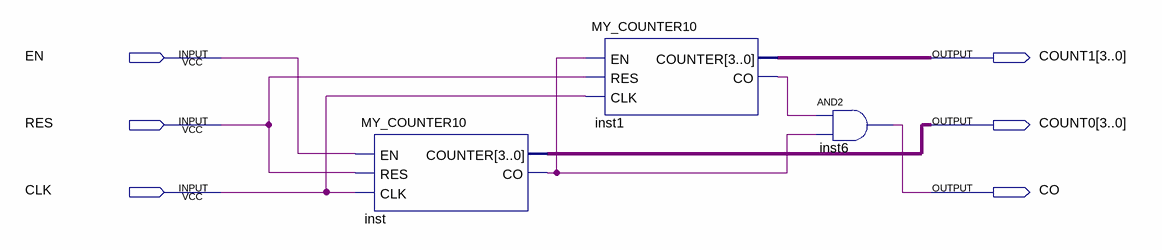
[diagram p0: schematic sheet]
// Quartus schematic MY_COUNTER100.bdf as structural Verilog: 3 symbols, 6 pins
module MY_COUNTER100 (
  input  EN,
  input  RES,
  input  CLK,
  output [3:0] COUNT1,
  output [3:0] COUNT0,
  output CO
);

  wire inst1_co, inst_co;

  MY_COUNTER10 inst (.EN(EN), .RES(RES), .CLK(CLK), .COUNTER(COUNT0), .CO(inst_co));
  MY_COUNTER10 inst1 (.EN(inst_co), .RES(RES), .CLK(CLK), .COUNTER(COUNT1), .CO(inst1_co));
  and inst6 (CO, inst1_co, inst_co);
endmodule
